# EAGLE design alpha_board (EAGLE 6.5.0)
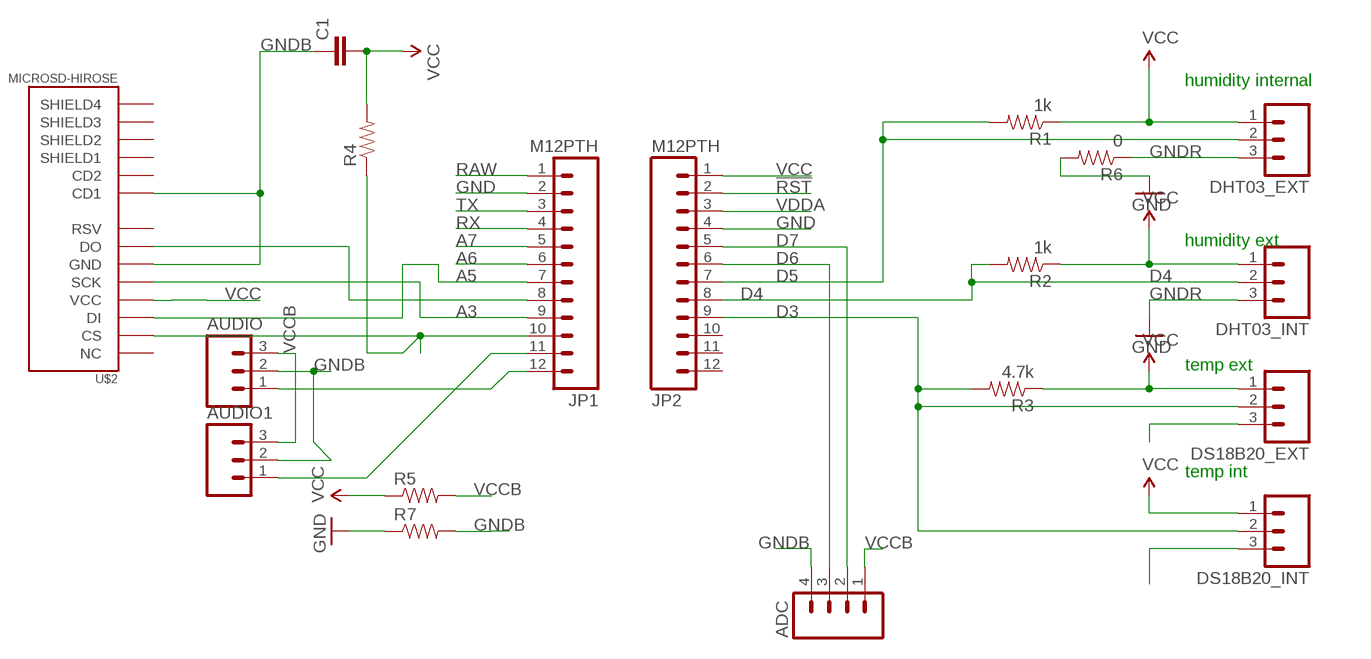
[diagram p0: schematic, sheet 1]

## Parts
ADC  M04LOCK_LONGPADS  [1X04_LOCK_LONGPADS]
AUDIO  M03LOCK  [1X03_LOCK]
AUDIO1  M03LOCK  [1X03_LOCK]
C1  CAP1206  [1206]
DHT03_EXT  M03LOCK  [1X03_LOCK]
DHT03_INT  M03LOCK  [1X03_LOCK]
DS18B20_EXT  M03LOCK  [1X03_LOCK]
DS18B20_INT  M03LOCK  [1X03_LOCK]
JP1  M12PTH  [1X12-SMALL-PADS]
JP2  M12PTH  [1X12-SMALL-PADS]
R1  1k  RESISTOR1206  [1206]
R2  1k  RESISTOR1206  [1206]
R3  4.7k  RESISTOR1206  [1206]
R4  RESISTOR1206  [1206]
R5  RESISTOR1206  [1206]
R6  0  RESISTOR1206  [1206]
R7  RESISTOR1206  [1206]
U$2  MICROSD-HIROSE  [MICROSD_HOLDER-HIROSE-DM3AT]

## Nets
!RST: JP2.2
A3: JP1.9 U$2.CLK(SCK)
A5: JP1.7 U$2.CMD(DI)
A6: JP1.6
A7: JP1.5
D3: DS18B20_EXT.2 DS18B20_INT.2 JP2.9 R3.2
D4: DHT03_INT.2 JP2.8 R2.2
D5: DHT03_EXT.2 JP2.7 R1.2
D6: ADC.3 JP2.6
D7: ADC.2 JP2.5
GND: JP1.2 JP2.4 R6.2 R7.1
GNDB: ADC.4 AUDIO1.2 AUDIO.2 C1.1 DS18B20_EXT.3 DS18B20_INT.3 R7.2 U$2.CD1 U$2.VSS(GND)
GNDR: DHT03_EXT.3 DHT03_INT.3 R6.1 ; supply symbol labelled GND
N$1: JP1.10 R4.1 U$2.DAT3(CS)
N$2: AUDIO.1 JP1.12
N$3: JP1.8 U$2.DAT0(DO)
N$6: AUDIO1.1 JP1.11
RAW [vcc]: JP1.1
RX: JP1.4
TX: JP1.3
VCC: C1.2 DHT03_EXT.1 DHT03_INT.1 DS18B20_EXT.1 DS18B20_INT.1 JP2.1 R1.1 R2.1 R3.1 R4.2 R5.1 U$2.VDD(VCC)
VCCB: ADC.1 AUDIO1.3 AUDIO.3 R5.2
VDDA: JP2.3
Unconnected: JP2.10 JP2.11 JP2.12 U$2.BODY1(SHIELD1) U$2.BODY2(SHIELD2) U$2.BODY3(SHIELD3) U$2.BODY4(SHIELD4) U$2.CD2 U$2.DAT1(RSV) U$2.DAT2(NC)

## Notes on the sheet
- humidity internal
- humidity ext
- temp ext
- temp int

## Library data of the parts
ADC = SparkFun-Connectors:M04: Header 4 Standard 4-pin 0.1" header. Use with straight break away headers (SKU : PRT-00116), right angle break away headers (PRT-00553), swiss pins (PRT-00743), machine pins (PRT-00117), and female headers (PRT-00115). Molex polarized connector foot print use with SKU : PRT-08231 with associated crimp pins and housings. 1MM SMD Version SKU: PRT-10208
AUDIO AUDIO1 DHT03_EXT DHT03_INT DS18B20_EXT DS18B20_INT = SparkFun:M03: Header 3 Standard 3-pin 0.1" header. Use with straight break away headers (SKU : PRT-00116), right angle break away headers (PRT-00553), swiss pins (PRT-00743), machine pins (PRT-00117), and female headers (PRT-00115). Molex polarized connector foot print use with SKU : PRT-08232 with associated crimp pins and housings.
C1 = SparkFun:CAP: Capacitor Standard 0603 ceramic capacitor, and 0.1" leaded capacitor.
JP1 JP2 = Spark:M12: Header 12 Standard 12-pin 0.1" header. Use with straight break away headers (SKU : PRT-00116), right angle break away headers (PRT-00553), swiss pins (PRT-00743), machine pins (PRT-00117), and female headers (PRT-00115).
R1-R7 = SparkFun:RESISTOR: Resistor Basic schematic elements and footprints for 0603, 1206, and PTH resistors.
U$2 = calculator_lib:MICROSD-HIROSE

## Board
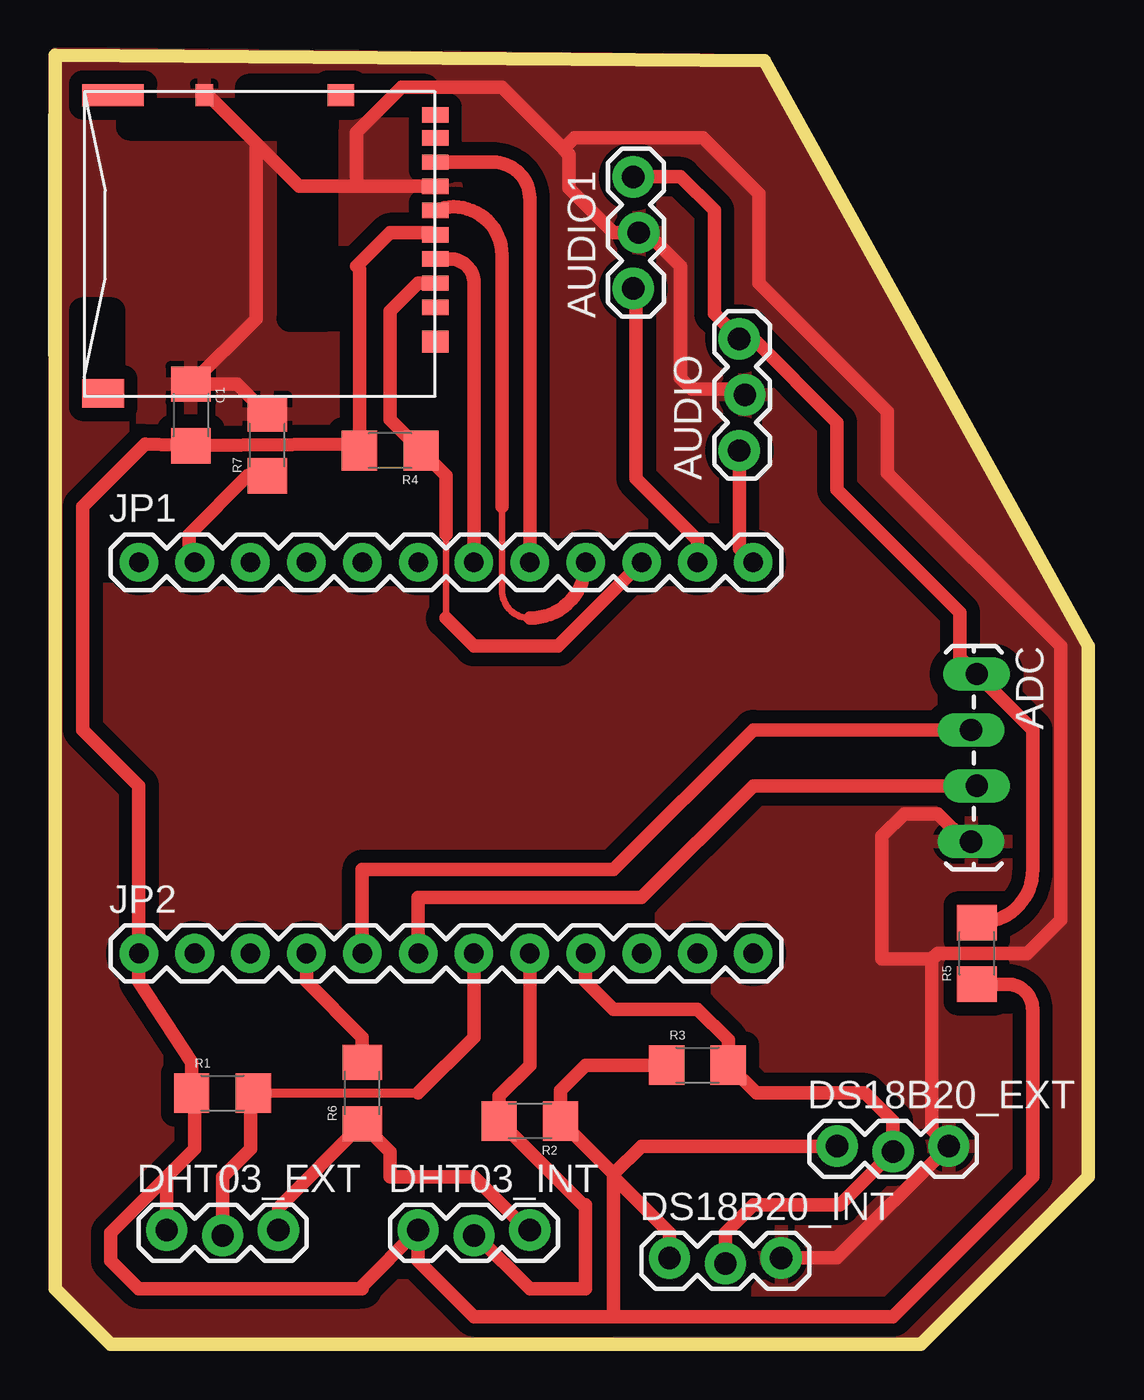
[diagram p1: board, top side]
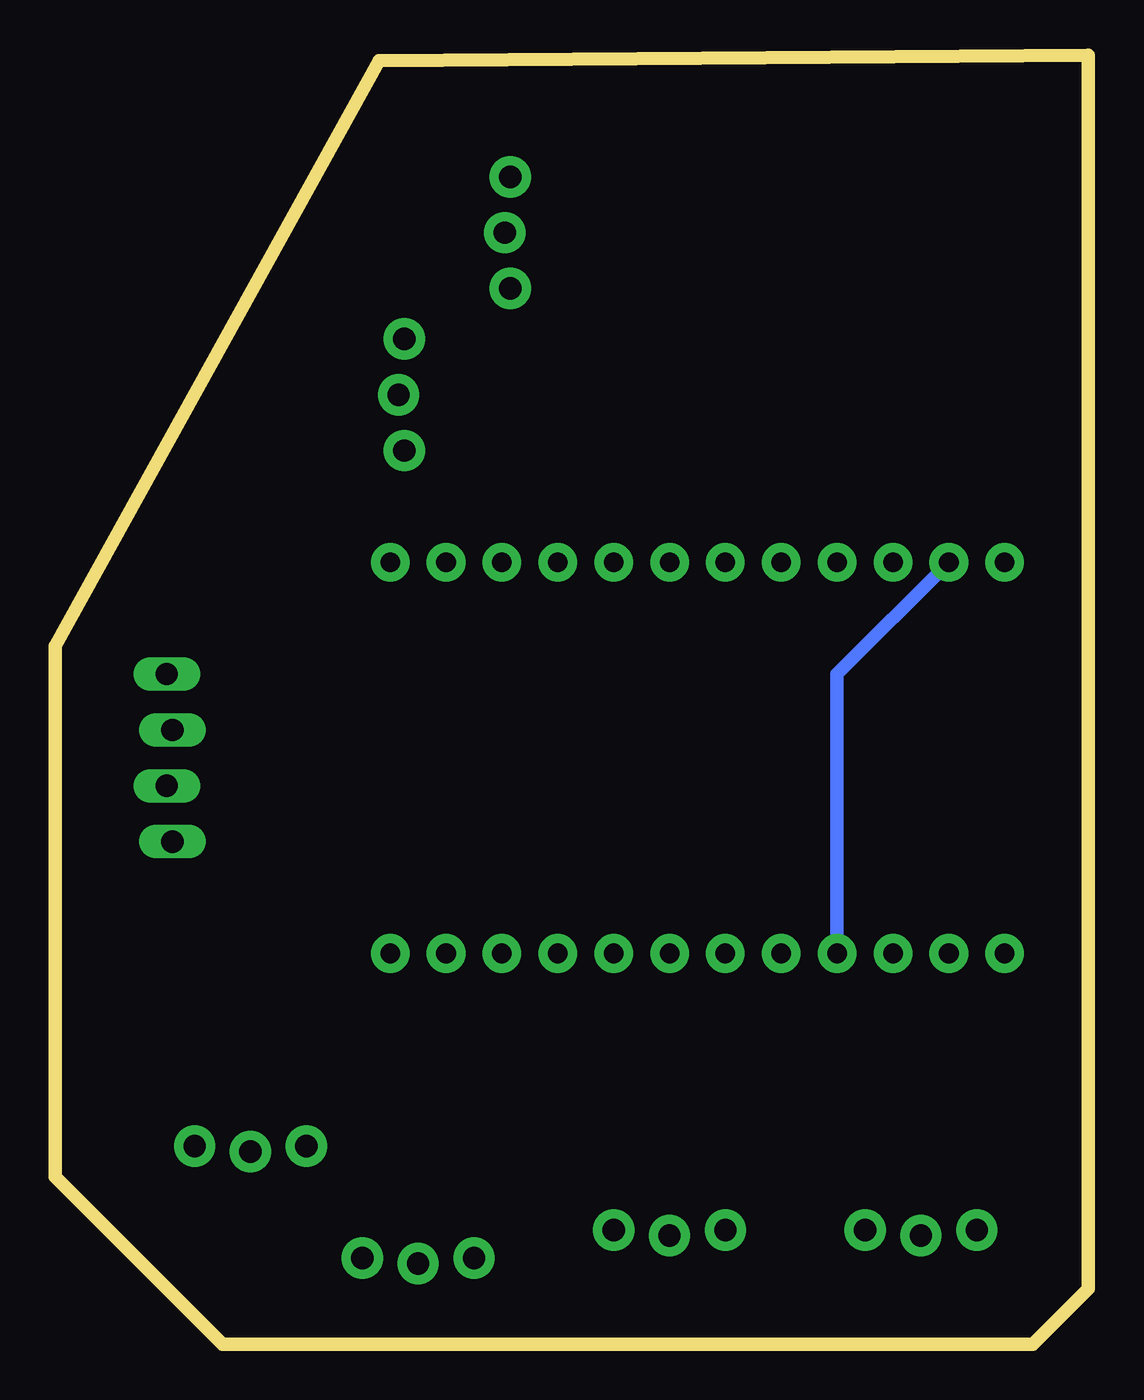
[diagram p2: board, bottom side, seen from below]

Size 46.99 x 58.62 mm. Coordinates in mm from the lower left corner, seen from the top.
Outline: 0,58.62 0,2.54 2.54,0 39.37,0 46.99,7.62 46.99,31.75 32.26,58.37 0,58.62
Copper layers (1*16): Top 0.035mm / dielectric 1.5mm / Bottom 0.035mm
Design rules "default *": minimum track width 10mil, minimum drill 24mil, track to track 8mil, track to pad 8mil, pad to pad 8mil, via to via 8mil, smd to smd 8mil, copper to edge 0mil, drill to drill 8mil, minimum pad ring 10mil, minimum via ring 8mil, stop-mask expansion 4mil, vias tented up to drill 0mil, thermal gap 10mil

### Footprints (pad centres in the part's own frame; a part is rotated, then mirrored left to right if it is on the bottom)
1X04_LOCK_LONGPADS = drill 1.016 long: 1 0,0; 2 2.54,-0.254; 3 5.08,0; 4 7.62,-0.254
1X03_LOCK = drill 1.016 pad 1.88: 1 0,0.127; 2 2.54,-0.127; 3 5.08,0.127
1206 = smd 1.6 x 1.8: 1 -1.4,0; 2 1.4,0
1X12-SMALL-PADS = drill 0.889 pad 1.753: 1 0,0; 2 2.54,0; 3 5.08,0; 4 7.62,0; 5 10.16,0; 6 12.7,0; 7 15.24,0; 8 17.78,0; 9 20.32,0; 10 22.86,0; 11 25.4,0; 12 27.94,0
MICROSD_HOLDER-HIROSE-DM3AT = smd 1 x 2.8: BODY1 -6.35,-14.65 | smd 1 x 1.2: BODY2 -6.35,-4.3; BODY4 4.85,0 | smd 1.3 x 1.9: BODY3 7.2,-15.1 | smd 1 x 0.8: CD1 -6.35,-10.5 | smd 0.7 x 1.2: CD2 -5.45,0; CLK -1.1,0; CMD 1.1,0; DAT0 -3.3,0; DAT1 -4.4,0; DAT2 3.3,0; DAT3 2.2,0; VDD 0,0; VSS -2.2,0

### Placement (x,y rotation side)
ADC  41.91,30.48 270 top
AUDIO  31.24,40.64 90 top
AUDIO1  26.42,48.01 90 top
C1  6.18,42.26 270 top
DHT03_EXT  5.08,5.08 0 top
DHT03_INT  16.51,5.08 0 top
DS18B20_EXT  35.56,8.89 0 top
DS18B20_INT  27.94,3.81 0 top
JP1  3.81,35.56 0 top
JP2  3.81,17.78 0 top
R1  7.62,11.43 0 top
R2  21.59,10.16 180 top
R3  29.21,12.7 0 top
R4  15.24,40.64 180 top
R5  41.91,17.78 90 top
R6  13.97,11.43 90 top
R7  9.65,40.89 90 top
U$2  17.29,50.45 270 top

### Tracks (layer width: path | path; a pad name or v marks a point on that pad's centre or on a via)
A3
  Top 0.305: 21.59,33.02 arc-90 20.32,34.29 20.32,38.1
  Top 0.61: JP1.9 arc-90 21.59,33.02 | 20.32,38.1 20.32,49.53 arc113 U$2.CLK
A5
  Top 0.61: JP1.7 19.05,48.26 arc90 17.96,49.35 U$2.CMD
D3
  Top 0.61: R3.2 30.61,13.84 29.21,15.24 25.4,15.24 24.13,16.51 JP2.9 | 30.48,12.57 R3.2 | R3.2 31.88,11.43 36.83,11.43 38.1,10.16 DS18B20_EXT.2 35.69,6.35 31.75,6.35 30.48,5.08 DS18B20_INT.2
D4
  Top 0.61: 21.72,17.65 JP2.8 21.59,12.7 20.19,11.3 R2.2 24,6.35 24.13,6.35 24.13,2.54 21.59,2.54 19.18,4.95 DHT03_INT.2
D5
  Top 0.406: R1.2 16.51,11.43
  Top 0.61: DHT03_EXT.2 7.62,7.62 8.89,8.89 8.89,11.3 R1.2 | 16.51,11.43 19.05,13.97 JP2.7
D6
  Top 0.61: ADC.3 31.75,25.4 26.67,20.32 16.51,20.32 JP2.6
D7
  Top 0.61: JP2.5 13.97,21.59 25.4,21.59 31.75,27.94 ADC.2
GND
  Top 0.254: 11.94,17.53 JP2.4
  Top 0.61: R6.2 13.97,13.97 11.43,16.51 JP2.4 | 6.52,35.73 JP1.2 6.1,35.81 6.1,36.83 8.76,39.49 R7.1
  Bottom 0.61: JP2.4 11.43,30.48 JP1.2
GNDB
  Top 0.61: AUDIO.2 31.12,43.43 28.96,43.43 28.45,43.94 28.45,49.02 26.92,50.55 AUDIO1.2 25.4,50.55 23.37,52.58 23.37,54.1 23.11,54.36 | ADC.4 41.4,22.86 40.13,24.13 38.61,24.13 37.59,23.11 37.59,17.53 39.88,17.53 | U$2.CD1 6.95,56.8 9.14,54.61 | R7.2 8.29,43.66 C1.1 9.14,46.62 9.14,54.61 | U$2.VSS 13.72,52.65 | 13.72,52.65 11.1,52.65 9.14,54.61 | 23.11,54.36 20.32,57.15 15.75,57.15 13.72,55.12 13.72,52.65 | 39.88,17.53 40.13,17.78 44.2,17.78 45.72,19.3 45.72,31.75 37.85,39.62 37.85,42.42 32,48.26 32,52.32 29.46,54.86 23.62,54.86 23.11,54.36 | DS18B20_INT.3 35.56,3.94 DS18B20_EXT.3 39.88,9.78 39.88,17.53
  pour Top (isolate 0.61): 0.05,58.67 0,2.54 2.54,0 39.37,0 46.99,7.62 46.99,31.75 32.26,58.37
GNDR
  Top 0.61: DHT03_EXT.3 10.16,6.22 R6.1 15.24,8.76 15.24,7.62 19.05,7.62 21.46,5.21 DHT03_INT.3
N$1
  Top 0.305: 17.78,36.83 17.78,33.02
  Top 0.61: U$2.DAT3 16.5,48.25 15.24,46.99 15.24,42.04 R4.1 17.78,39.5 17.78,36.83 | 17.78,33.02 19.05,31.75 22.86,31.75 JP1.10
N$2
  Top 0.61: JP1.12 31.12,36.2 AUDIO.1
N$3
  Top 0.61: JP1.8 21.59,52.07 arc90 19.91,53.75 U$2.DAT0
N$6
  Top 0.61: AUDIO1.1 26.42,47.88 26.42,39.37 29.21,36.58 JP1.11
VCC
  Top 0.61: DHT03_EXT.1 5.08,7.62 | 5.08,7.62 6.35,8.89 6.35,11.3 R1.1 6.22,12.83 3.81,16.51 JP2.1 3.81,25.4 1.27,27.94 1.27,38.1 4.1,40.93 C1.2 13.17,40.93 13.21,40.89 13.59,40.89 R4.2 | 5.08,7.62 2.54,5.08 2.54,3.81 3.81,2.54 13.84,2.54 13.91,2.6 | 13.91,2.6 DHT03_INT.1 16.51,3.81 19.05,1.27 25.4,1.27 | 13.97,2.54 13.91,2.6 | 25.4,1.27 25.4,7.62 | 25.4,7.62 25.4,7.75 | 25.4,7.75 R2.1 22.99,11.56 24.13,12.7 R3.1 | DS18B20_EXT.1 26.67,9.02 25.4,7.75 | 25.4,1.27 38.1,1.27 44.45,7.62 44.45,15.24 arc90 43.31,16.38 R5.1 | DS18B20_INT.1 27.94,5.08 25.4,7.62 | R4.2 13.67,40.47 | U$2.VDD 17.19,50.55 15.24,50.55 13.72,49.02 13.84,48.9 R4.2
VCCB
  Top 0.61: R5.2 42.04,19.18 arc90 44.45,21.59 44.45,27.94 ADC.1 41.15,31.24 41.15,33.27 35.56,38.86 35.56,41.91 31.75,45.72 AUDIO.3 29.97,46.86 29.97,51.56 28.45,53.09 AUDIO1.3